# EAGLE design 324duino (EAGLE 5.09)
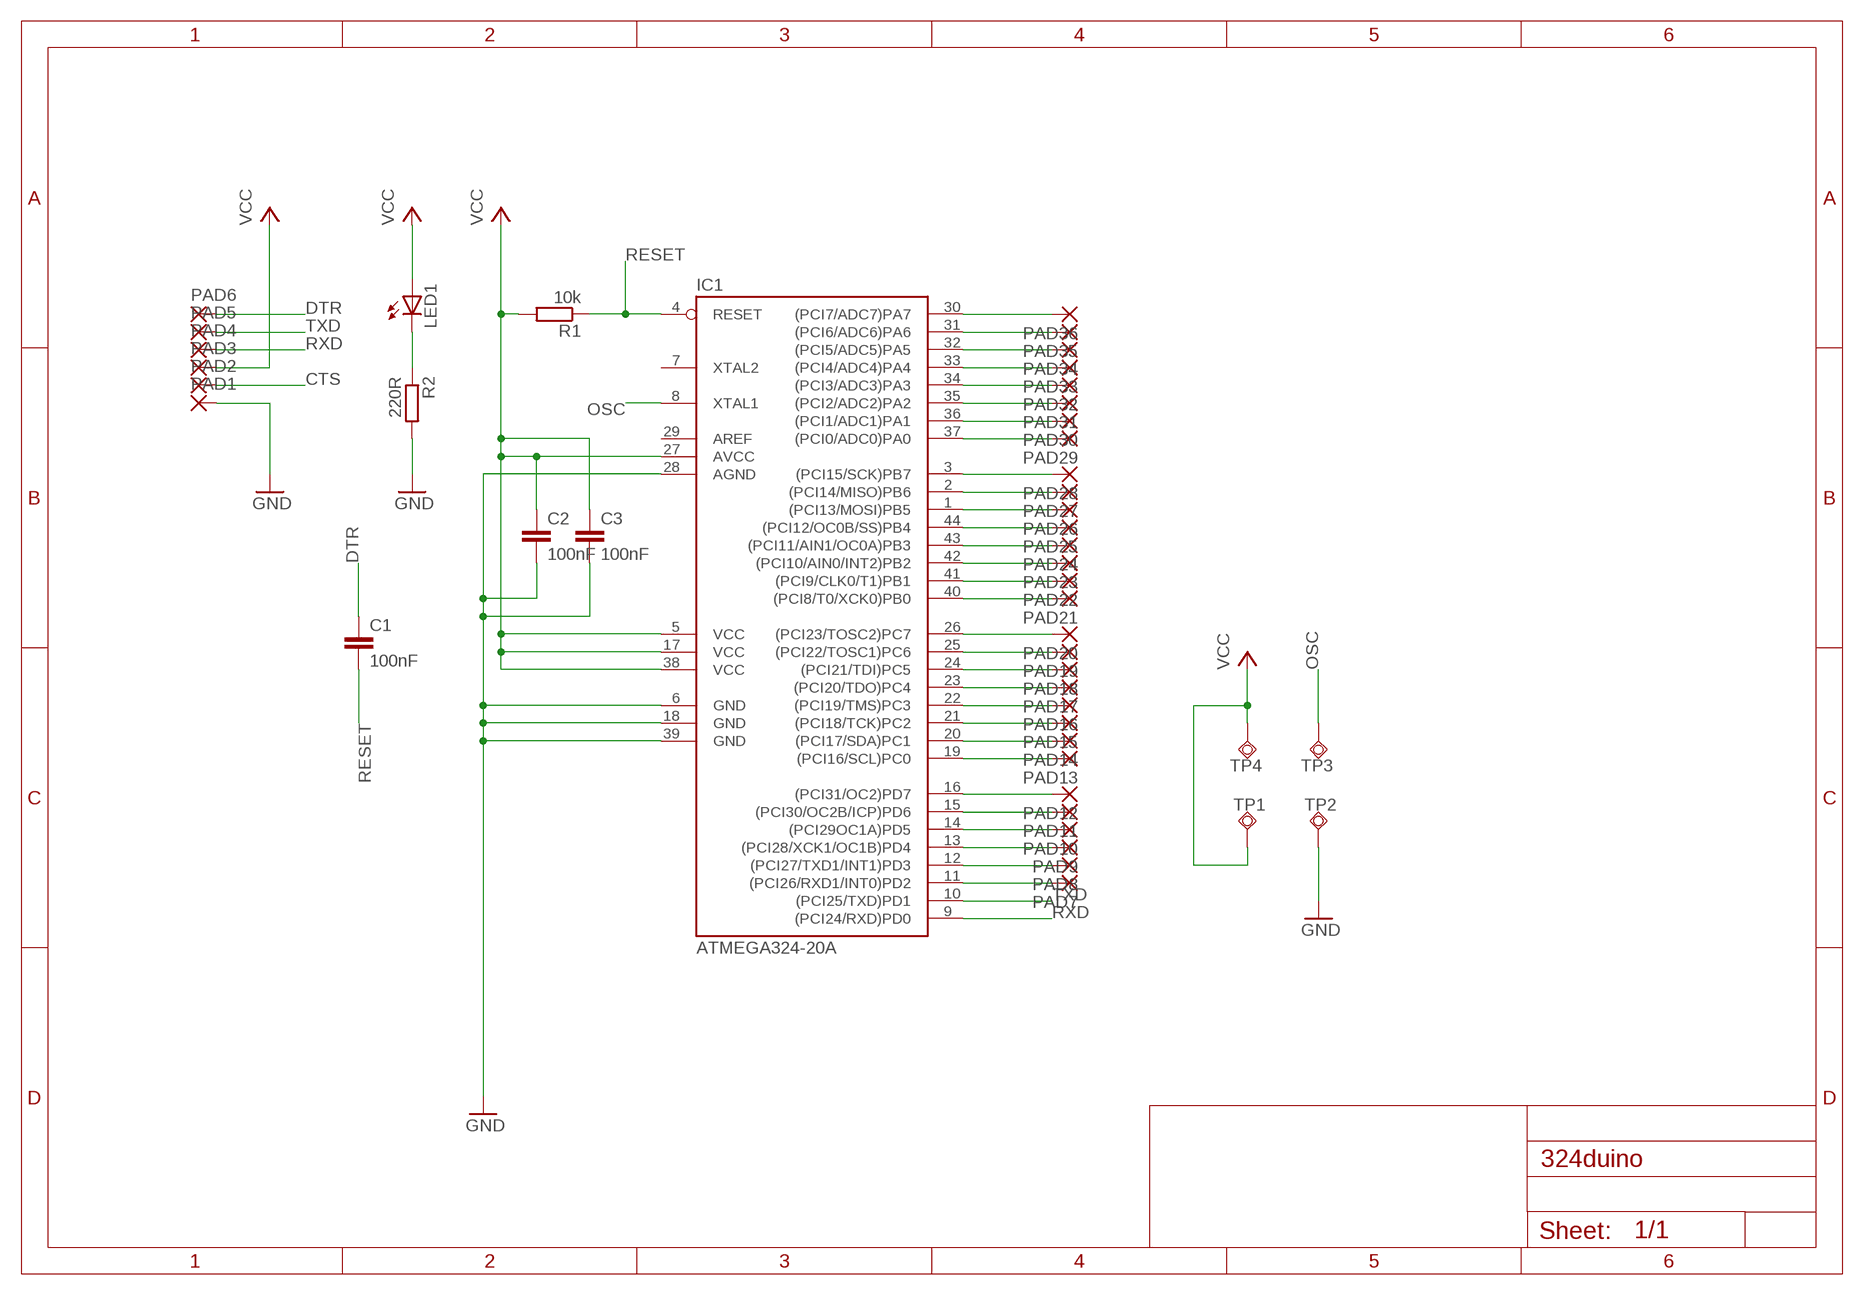
[diagram p0: schematic, sheet 1]

## Parts
C1  100nF  C-EUC0603K  [C0603K]
C2  100nF  C-EUC0603K  [C0603K]
C3  100nF  C-EUC0603K  [C0603K]
IC1  ATMEGA324-20A  [TQFP44]
LED1  LEDCHIP-LED0603  [CHIP-LED0603]
PAD1  SMD2  [SMD1,27-2,54]
PAD2  SMD2  [SMD1,27-2,54]
PAD3  SMD2  [SMD1,27-2,54]
PAD4  SMD2  [SMD1,27-2,54]
PAD5  SMD2  [SMD1,27-2,54]
PAD6  SMD2  [SMD1,27-2,54]
PAD7  SMD2  [SMD1,27-2,54]
PAD8  SMD2  [SMD1,27-2,54]
PAD9  SMD2  [SMD1,27-2,54]
PAD10  SMD2  [SMD1,27-2,54]
PAD11  SMD2  [SMD1,27-2,54]
PAD12  SMD2  [SMD1,27-2,54]
PAD13  SMD2  [SMD1,27-2,54]
PAD14  SMD2  [SMD1,27-2,54]
PAD15  SMD2  [SMD1,27-2,54]
PAD16  SMD2  [SMD1,27-2,54]
PAD17  SMD2  [SMD1,27-2,54]
PAD18  SMD2  [SMD1,27-2,54]
PAD19  SMD2  [SMD1,27-2,54]
PAD20  SMD2  [SMD1,27-2,54]
PAD21  SMD2  [SMD1,27-2,54]
PAD22  SMD2  [SMD1,27-2,54]
PAD23  SMD2  [SMD1,27-2,54]
PAD24  SMD2  [SMD1,27-2,54]
PAD25  SMD2  [SMD1,27-2,54]
PAD26  SMD2  [SMD1,27-2,54]
PAD27  SMD2  [SMD1,27-2,54]
PAD28  SMD2  [SMD1,27-2,54]
PAD29  SMD2  [SMD1,27-2,54]
PAD30  SMD2  [SMD1,27-2,54]
PAD31  SMD2  [SMD1,27-2,54]
PAD32  SMD2  [SMD1,27-2,54]
PAD33  SMD2  [SMD1,27-2,54]
PAD34  SMD2  [SMD1,27-2,54]
PAD35  SMD2  [SMD1,27-2,54]
PAD36  SMD2  [SMD1,27-2,54]
R1  10k  R-EU_R0603  [R0603]
R2  220R  R-EU_R0603  [R0603]
TP1  TPSQTP20SQ  [TP20SQ]
TP2  TPSQTP20SQ  [TP20SQ]
TP3  TPSQTP20SQ  [TP20SQ]
TP4  TPSQTP20SQ  [TP20SQ]

## Nets
CTS: PAD2.1(P)
DTR: C1.1 PAD6.1(P)
GND: C2.2 C3.2 IC1.6(GND) IC1.18(GND) IC1.28(AGND) IC1.39(GND) PAD1.1(P) R2.2 TP2.TP
N$1: IC1.3((PCI15/SCK)PB7) PAD28.1(P)
N$2: IC1.2((PCI14/MISO)PB6) PAD27.1(P)
N$3: IC1.1((PCI13/MOSI)PB5) PAD26.1(P)
N$6: IC1.37((PCI0/ADC0)PA0) PAD29.1(P)
N$7: IC1.36((PCI1/ADC1)PA1) PAD30.1(P)
N$8: IC1.35((PCI2/ADC2)PA2) PAD31.1(P)
N$9: IC1.34((PCI3/ADC3)PA3) PAD32.1(P)
N$10: IC1.33((PCI4/ADC4)PA4) PAD33.1(P)
N$11: IC1.32((PCI5/ADC5)PA5) PAD34.1(P)
N$12: IC1.31((PCI6/ADC6)PA6) PAD35.1(P)
N$13: IC1.30((PCI7/ADC7)PA7) PAD36.1(P)
N$14: IC1.44((PCI12/OC0B/SS)PB4) PAD25.1(P)
N$15: IC1.43((PCI11/AIN1/OC0A)PB3) PAD24.1(P)
N$16: IC1.42((PCI10/AIN0/INT2)PB2) PAD23.1(P)
N$17: IC1.41((PCI9/CLK0/T1)PB1) PAD22.1(P)
N$18: IC1.40((PCI8/T0/XCK0)PB0) PAD21.1(P)
N$19: IC1.26((PCI23/TOSC2)PC7) PAD20.1(P)
N$20: IC1.25((PCI22/TOSC1)PC6) PAD19.1(P)
N$21: IC1.24((PCI21/TDI)PC5) PAD18.1(P)
N$22: IC1.23((PCI20/TDO)PC4) PAD17.1(P)
N$23: IC1.22((PCI19/TMS)PC3) PAD16.1(P)
N$24: IC1.21((PCI18/TCK)PC2) PAD15.1(P)
N$25: IC1.20((PCI17/SDA)PC1) PAD14.1(P)
N$26: IC1.19((PCI16/SCL)PC0) PAD13.1(P)
N$27: IC1.16((PCI31/OC2)PD7) PAD12.1(P)
N$28: IC1.15((PCI30/OC2B/ICP)PD6) PAD11.1(P)
N$29: IC1.14((PCI29OC1A)PD5) PAD10.1(P)
N$30: IC1.13((PCI28/XCK1/OC1B)PD4) PAD9.1(P)
N$31: IC1.12((PCI27/TXD1/INT1)PD3) PAD8.1(P)
N$32: IC1.11((PCI26/RXD1/INT0)PD2) PAD7.1(P)
N$33: LED1.C R2.1
OSC: IC1.8(XTAL1) TP3.TP
RESET: C1.2 IC1.4(RESET) R1.1
RXD: IC1.9((PCI24/RXD)PD0) PAD4.1(P)
TXD: IC1.10((PCI25/TXD)PD1) PAD5.1(P)
VCC: C2.1 C3.1 IC1.5(VCC) IC1.17(VCC) IC1.27(AVCC) IC1.38(VCC) LED1.A PAD3.1(P) R1.2 TP1.TP TP4.TP
Unconnected: IC1.7(XTAL2)

## Power pins joined to a net without a drawn wire
AREF: IC1.29(AREF)

## Library data of the parts
C1-C3 = rcl:C-EU: CAPACITOR, European symbol
IC1 = avr:ATMEGA324: MICROCONTROLLER 32 Kbytes FLASH 1 kBytes SRAM 1 kBytes EEPROM DUAL USART 8-channel 10 bit ADC
LED1 = led:LED: LED OSRAM: - CHIPLED LG R971, LG N971, LY N971, LG Q971, LY Q971, LO R971, LY R971 LH N974, LH R974 LS Q976, LO Q976, LY Q976 LO Q996 - Hyper CHIPLED LW Q18S LB Q993, LB Q99A, LB R99A - SideLED LS A670, LO A670, LY A670, LG A670, LP A670 LB A673, LV A673, LT A673, LW A673 LH A674 LY A675 LS A676, LA A676, LO A676, LY A676, LW A676 LS A679, LY A679, LG A679 - Hyper Micro SIDELED® LS Y876, LA Y876, LO Y876, LY Y876 LT Y87S - SmartLED LW L88C, LW L88S LB L89C, LB L89S, LG L890 LS L89K, LO L89K, LY L89K LS L896, LA L896, LO L896, LY L896 - TOPLED LS T670, LO T670, LY T670, LG T670, LP T670 LSG T670, LSP T670, LSY T670, LOP T670, LYG T670 LG T671, LOG T671, LSG T671 LB T673, LV T673, LT T673, LW T673 LH T674 LS T676, LA T676, LO T676, LY T676, LB T676, LH T676, LSB T676, LW T676 LB T67C, LV T67C, LT T67C, LS T67K, LO T67K, LY T67K, LW E67C LS E67B, LA E67B, LO E67B, LY E67B, LB E67C, LV E67C, LT E67C LW T67C LS T679, LY T679, LG T679 LS T770, LO T770, LY T770, LG T770, LP T770 LB T773, LV T773, LT T773, LW T773 LH T774 LS E675, LA E675, LY E675, LS T675 LS T776, LA T776, LO T776, LY T776, LB T776 LHGB T686 LT T68C, LB T68C - Hyper Mini TOPLED® LB M676 - Mini TOPLED Santana® LG M470 LS M47K, LO M47K, LY M47K Source: http://www.osram.convergy.de LUXEON: - LUMILED® LXK2-PW12-R00, LXK2-PW12-S00, LXK2-PW14-U00, LXK2-PW14-V00 LXK2-PM12-R00, LXK2-PM12-S00, LXK2-PM14-U00 LXK2-PE12-Q00, LXK2-PE12-R00, LXK2-PE12-S00, LXK2-PE14-T00, LXK2-PE14-U00 LXK2-PB12-K00, LXK2-PB12-L00, LXK2-PB12-M00, LXK2-PB14-N00, LXK2-PB14-P00, LXK2-PB14-Q00 LXK2-PR12-L00, LXK2-PR12-M00, LXK2-PR14-Q00, LXK2-PR14-R00 LXK2-PD12-Q00, LXK2-PD12-R00, LXK2-PD12-S00 LXK2-PH12-R00, LXK2-PH12-S00 LXK2-PL12-P00, LXK2-PL12-Q00, LXK2-PL12-R00 Source: www.luxeon.com KINGBRIGHT: KA-3528ASYC Source: www.kingbright.com
PAD1-PAD36 = wirepad:SMD2: SMD PAD
R1 R2 = resistor:R-EU_: RESISTOR, European symbol
TP1-TP4 = testpad:TPSQ: Test pad

## Board
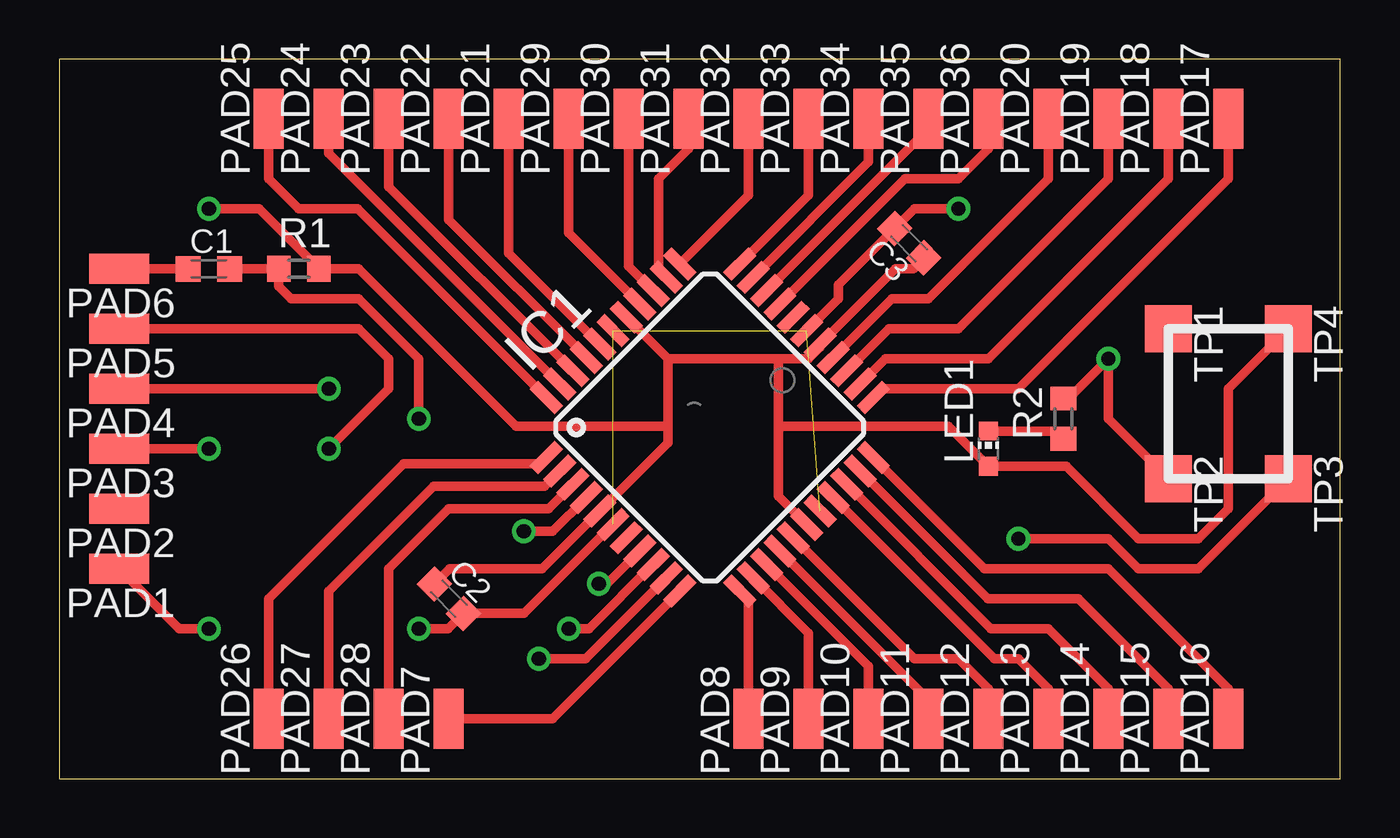
[diagram p1: board, top side]
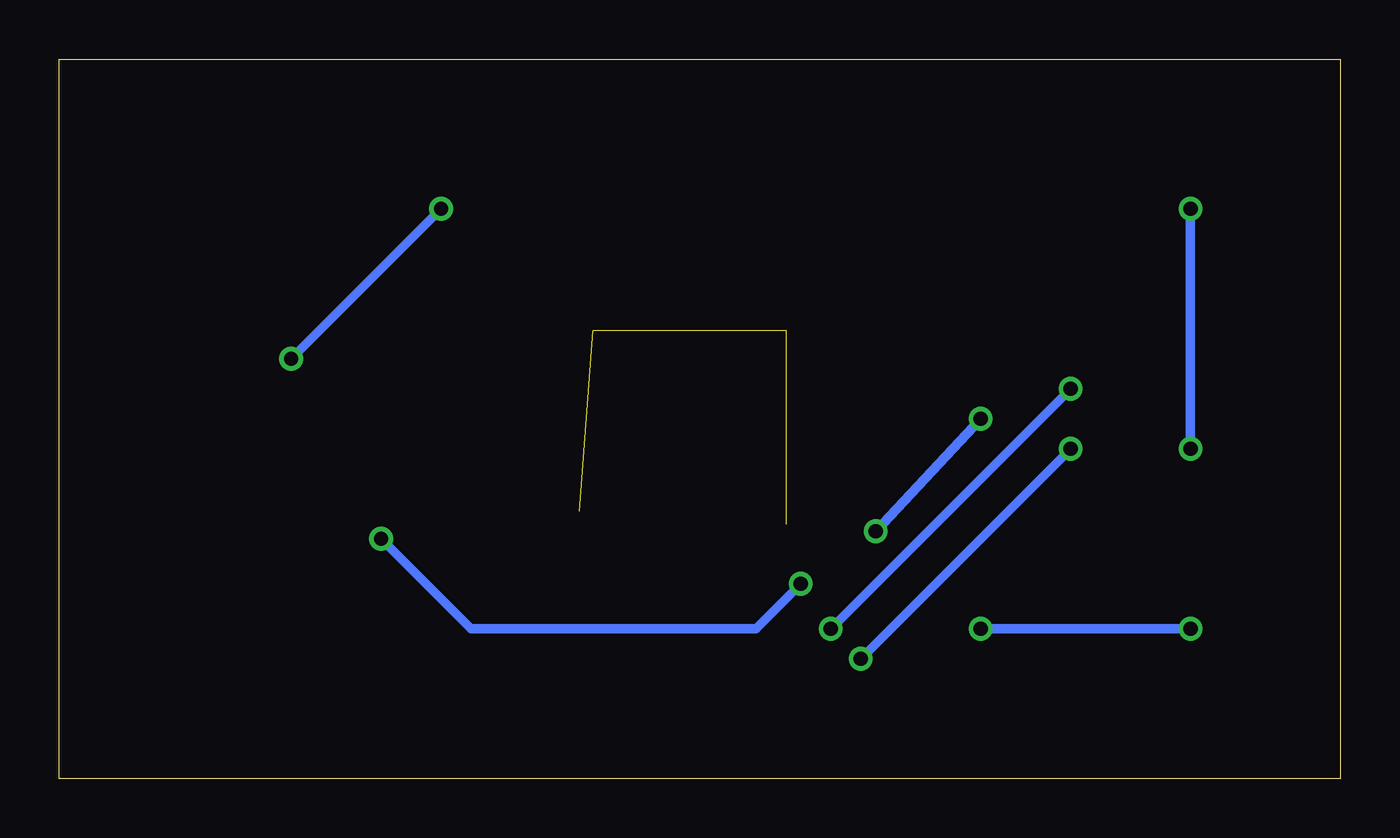
[diagram p2: board, bottom side, seen from below]

Size 54.28 x 30.47 mm. Coordinates in mm from the lower left corner, seen from the top.
Outline: 0,0 54.28,0 54.28,30.47 0,30.47 0,0
Copper layers (1*16): Top 0.035mm / dielectric 1.5mm / Bottom 0.035mm
Design rules "default": minimum track width 10mil, minimum drill 24mil, track to track 8mil, track to pad 8mil, pad to pad 8mil, via to via 8mil, smd to smd 8mil, copper to edge 40mil, drill to drill 8mil, minimum pad ring 10mil, minimum via ring 8mil, stop-mask expansion 4mil, vias tented up to drill 0mil, thermal gap 10mil

### Footprints (pad centres in the part's own frame; a part is rotated, then mirrored left to right if it is on the bottom)
C0603K = smd 1.05 x 1.08: 1 -0.875,0; 2 0.875,0
TQFP44 = smd 1.5 x 0.5: 1 -5.8,4; 2 -5.8,3.2; 3 -5.8,2.4; 4 -5.8,1.6; 5 -5.8,0.8; 6 -5.8,0; 7 -5.8,-0.8; 8 -5.8,-1.6; 9 -5.8,-2.4; 10 -5.8,-3.2; 11 -5.8,-4; 23 5.8,-4; 24 5.8,-3.2; 25 5.8,-2.4; 26 5.8,-1.6; 27 5.8,-0.8; 28 5.8,0; 29 5.8,0.8; 30 5.8,1.6; 31 5.8,2.4; 32 5.8,3.2; 33 5.8,4 | smd 0.5 x 1.5: 12 -4,-5.8; 13 -3.2,-5.8; 14 -2.4,-5.8; 15 -1.6,-5.8; 16 -0.8,-5.8; 17 0,-5.8; 18 0.8,-5.8; 19 1.6,-5.8; 20 2.4,-5.8; 21 3.2,-5.8; 22 4,-5.8; 34 4,5.8; 35 3.2,5.8; 36 2.4,5.8; 37 1.6,5.8; 38 0.8,5.8; 39 0,5.8; 40 -0.8,5.8; 41 -1.6,5.8; 42 -2.4,5.8; 43 -3.2,5.8; 44 -4,5.8
CHIP-LED0603 = smd 0.8 x 0.8: A 0,-0.75; C 0,0.75
SMD1,27-2,54 = smd 1.27 x 2.54: 1 0,0
R0603 = smd 1 x 1.1: 1 -0.85,0; 2 0.85,0
TP20SQ = smd 2 x 2: TP 0,0

### Placement (x,y rotation side)
C1  6.35,21.59 0 top
C2  16.51,7.62 315 top
C3  36.01,22.67 135 top
IC1  27.57,14.87 45 top
LED1  39.37,13.97 0 top
PAD1  2.54,8.89 90 top
PAD2  2.54,11.43 90 top
PAD3  2.54,13.97 90 top
PAD4  2.54,16.51 90 top
PAD5  2.54,19.05 90 top
PAD6  2.54,21.59 90 top
PAD7  16.51,2.54 0 top
PAD8  29.21,2.54 0 top
PAD9  31.75,2.54 0 top
PAD10  34.29,2.54 0 top
PAD11  36.83,2.54 0 top
PAD12  39.37,2.54 0 top
PAD13  41.91,2.54 0 top
PAD14  44.45,2.54 0 top
PAD15  46.99,2.54 0 top
PAD16  49.53,2.54 0 top
PAD17  49.53,27.94 0 top
PAD18  46.99,27.94 0 top
PAD19  44.45,27.94 0 top
PAD20  41.91,27.94 0 top
PAD21  19.05,27.94 0 top
PAD22  16.51,27.94 0 top
PAD23  13.97,27.94 0 top
PAD24  11.43,27.94 0 top
PAD25  8.89,27.94 0 top
PAD26  8.89,2.54 0 top
PAD27  11.43,2.54 0 top
PAD28  13.97,2.54 0 top
PAD29  21.59,27.94 0 top
PAD30  24.13,27.94 0 top
PAD31  26.67,27.94 0 top
PAD32  29.21,27.94 0 top
PAD33  31.75,27.94 0 top
PAD34  34.29,27.94 0 top
PAD35  36.83,27.94 0 top
PAD36  39.37,27.94 0 top
R1  10.16,21.59 0 top
R2  42.55,15.24 90 top
TP1  46.99,19.05 270 top
TP2  46.99,12.7 270 top
TP3  52.07,12.7 270 top
TP4  52.07,19.05 270 top

### Tracks (layer width: path | path; a pad name or v marks a point on that pad's centre or on a via)
DTR
  Top 0.406: PAD6.1 C1.1
GND  (via drill 0.6)  (3 unrouted)
  Top 0.406: IC1.28 33.02,20.32 33.02,20.92 C3.2 36.23,24.13 v38.1,24.13 | IC1.6 19.7,7 C2.2 16.48,6.35 v15.24,6.35 | PAD1.1 5.08,6.35 v6.35,6.35 | R2.2 42.76,16.09 v44.45,17.78 44.45,15.24 TP2.TP
  Bottom 0.406: v6.35,6.35 v15.24,6.35 | v38.1,24.13 v44.45,17.78
N$1
  Top 0.406: PAD28.1 13.97,8.89 16.51,11.43 20.74,11.43 IC1.3
N$2
  Top 0.406: IC1.2 20.56,12.38 15.88,12.38 11.43,7.94 PAD27.1
N$3
  Top 0.406: IC1.1 20.38,13.34 14.61,13.34 8.89,7.62 PAD26.1
N$6
  Top 0.406: IC1.37 21.59,23.11 PAD29.1
N$7
  Top 0.406: IC1.36 24.13,21.7 PAD30.1
N$8
  Top 0.406: IC1.35 25.4,21.56 25.4,25.4 26.67,26.67 PAD31.1
N$9
  Top 0.406: IC1.34 29.21,24.71 PAD32.1
N$10
  Top 0.406: IC1.33 31.75,24.71 PAD33.1
N$11
  Top 0.406: IC1.32 34.29,26.12 PAD34.1
N$12
  Top 0.406: IC1.31 36.83,27.52 PAD35.1
N$13
  Top 0.406: IC1.30 35.84,25.4 38.1,25.4 39.37,26.67 PAD36.1
N$14
  Top 0.406: IC1.44 12.65,24.13 10.16,24.13 8.89,25.4 PAD25.1
N$15
  Top 0.406: IC1.43 11.43,26.48 PAD24.1
N$16
  Top 0.406: IC1.42 13.97,25.07 PAD23.1
N$17
  Top 0.406: IC1.41 16.51,23.66 PAD22.1
N$18
  Top 0.406: IC1.40 19.05,22.25 PAD21.1
N$19
  Top 0.406: 41.91,26.95 PAD20.1 41.91,25.4 36.83,20.32 35.28,20.32 IC1.26
N$20
  Top 0.406: IC1.25 35.14,19.05 38.1,19.05 44.45,25.4 PAD19.1
N$21
  Top 0.406: IC1.24 35.01,17.78 39.37,17.78 46.99,25.4 PAD18.1
N$22
  Top 0.406: IC1.23 34.87,16.51 40.64,16.51 49.53,25.4 PAD17.1
N$23
  Top 0.406: IC1.22 39.2,8.89 44.45,8.89 49.53,3.81 PAD16.1
N$24
  Top 0.406: IC1.21 39.34,7.62 43.18,7.62 46.99,3.81 PAD15.1
N$25
  Top 0.406: IC1.20 39.48,6.35 41.91,6.35 44.45,3.81 PAD14.1
N$26
  Top 0.406: IC1.19 39.62,5.08 40.64,5.08 41.91,3.81 PAD13.1
N$27
  Top 0.406: IC1.16 36.22,5.08 38.1,5.08 39.37,3.81 PAD12.1
N$28
  Top 0.406: IC1.15 36.83,3.34 PAD11.1
N$29
  Top 0.406: IC1.14 34.29,4.75 PAD10.1
N$30
  Top 0.406: IC1.13 31.75,6.16 PAD9.1
N$31
  Top 0.406: IC1.12 29.21,7.57 PAD8.1
N$32
  Top 0.406: PAD7.1 20.9,2.54 IC1.11
N$33
  Top 0.406: LED1.C 42.22,14.72 R2.1
OSC  (via drill 0.6)
  Top 0.406: IC1.8 23.22,8.26 v22.86,8.26 | TP3.TP 48.26,8.89 45.72,8.89 44.45,10.16 v40.64,10.16
  Bottom 0.406: v22.86,8.26 24.77,6.35 36.83,6.35 v40.64,10.16
RESET  (via drill 0.6)
  Top 0.406: IC1.4 20.91,10.48 v19.68,10.48 | v15.24,15.24 15.24,17.78 12.7,20.32 9.84,20.32 9.31,20.85 R1.1 C1.2
  Bottom 0.406: v15.24,15.24 v19.68,10.48
RXD  (via drill 0.6)
  Top 0.406: IC1.9 22.44,6.35 v21.59,6.35 | PAD4.1 v11.43,16.51
  Bottom 0.406: v11.43,16.51 v21.59,6.35
TXD  (via drill 0.6)
  Top 0.406: IC1.10 22.3,5.08 v20.32,5.08 | PAD5.1 12.7,19.05 13.97,17.78 13.97,16.51 v11.43,13.97
  Bottom 0.406: v11.43,13.97 v20.32,5.08
VCC  (via drill 0.6)
  Top 0.406: C3.1 36.63,22.02 36.2,21.59 35.42,21.59 IC1.27 32.23,18.27 31.75,17.78 30.48,17.78 | C2.1 16.54,8.89 20.46,8.89 IC1.5 25.79,14.22 25.79,14.92 | 25.79,17.78 IC1.38 | 25.79,17.78 30.48,17.78 | IC1.17 30.48,11.96 30.48,14.92 | 30.48,17.78 30.48,14.92 | 25.79,14.92 25.79,17.78 | TP1.TP TP4.TP 49.53,16.51 49.53,11.43 48.26,10.16 45.72,10.16 42.66,13.22 LED1.A 37.67,14.92 30.48,14.92 | 25.79,14.92 19.37,14.92 12.7,21.59 R1.2 8.47,24.13 v6.35,24.13 | PAD3.1 v6.35,13.97
  Bottom 0.406: v6.35,13.97 v6.35,24.13